# Altium schematic sheet External_Connectors.SchDoc
size A4; SheetNumber: 5; SheetTotal: 11
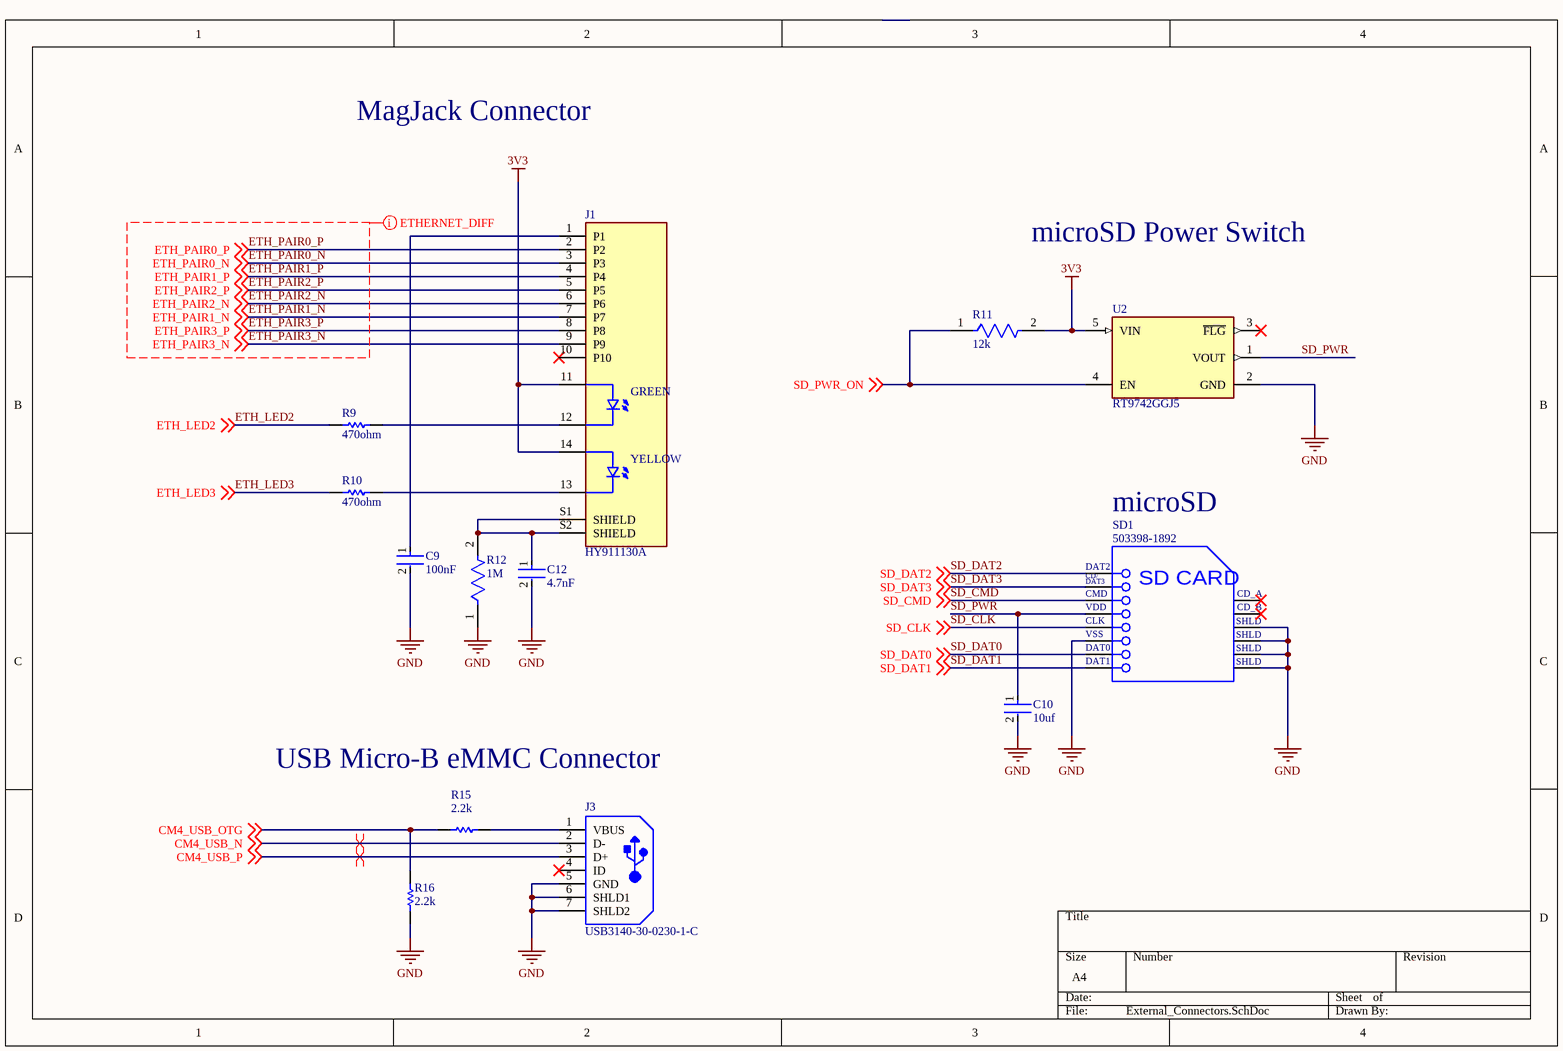
[diagram p0: External_Connectors.SchDoc]

## Parts
C9  100nF  [FP-C0402-BB-MFG]
C10  10uf  [FP-GRM188-0_2-IPC_C]
C12  4.7nF  [FP-0805-L_2_01_0_2-W_1_25-IPC_B]
J1  HY911130A  [HANRUN_HR911130A]
J3  USB3140-30-0230-1-C  [GCT-USB3140_V]
R9  470ohm  [RESC1005X40X25ML05T10]
R10  470ohm  [RESC1005X40X25ML05T10]
R11  12k  [FP-RC0402-0_4-IPC_C]
R12  1M  [FP-ERJ6EN-IPC_A]
R15  2.2k  [RESC1005X40X25LL05T05]
R16  2.2k  [RESC1005X40X25LL05T05]
SD1  503398-1892  [MOLX-503398-1892_V]
U2  RT9742GGJ5  [FP-RT9742GGJ5-IPC_C]

## Nets
3V3: J1.11 J1.14 R11.2 U2.5(VIN)
GND: C9.2 C10.2 C12.2 J3.5(GND) J3.6(SHLD1) J3.7(SHLD2) R12.1 R16.1 SD1.6(VSS) SD1.11(SHLD) SD1.12(SHLD) SD1.13(SHLD) SD1.14(SHLD) U2.2(GND)
CM4_USB_N: J3.2(D-) ; off-sheet CM4_USB_N
CM4_USB_OTG: R15.1 R16.2 ; off-sheet CM4_USB_OTG
CM4_USB_P: J3.3(D+) ; off-sheet CM4_USB_P
ETH_LED2: R9.1 ; off-sheet ETH_LED2
ETH_LED3: R10.1 ; off-sheet ETH_LED3
ETH_PAIR0_N: J1.3(P3) ; off-sheet ETH_PAIR0_N
ETH_PAIR0_P: J1.2(P2) ; off-sheet ETH_PAIR0_P
ETH_PAIR1_N: J1.7(P7) ; off-sheet ETH_PAIR1_N
ETH_PAIR1_P: J1.4(P4) ; off-sheet ETH_PAIR1_P
ETH_PAIR2_N: J1.6(P6) ; off-sheet ETH_PAIR2_N
ETH_PAIR2_P: J1.5(P5) ; off-sheet ETH_PAIR2_P
ETH_PAIR3_N: J1.9(P9) ; off-sheet ETH_PAIR3_N
ETH_PAIR3_P: J1.8(P8) ; off-sheet ETH_PAIR3_P
SD_CLK: SD1.5(CLK) ; off-sheet SD_CLK
SD_CMD: SD1.3(CMD) ; off-sheet SD_CMD
SD_DAT0: SD1.7(DAT0) ; off-sheet SD_DAT0
SD_DAT1: SD1.8(DAT1) ; off-sheet SD_DAT1
SD_DAT2: SD1.1(DAT2) ; off-sheet SD_DAT2
SD_DAT3: SD1.2(CD/DAT3) ; off-sheet SD_DAT3
SD_PWR: C10.1 SD1.4(VDD) U2.1(VOUT)
SD_PWR_ON: R11.1 U2.4(EN) ; off-sheet SD_PWR_ON
NetC9_1: C9.1 J1.1(P1)
NetC12_1: C12.1 J1.S1(SHIELD) J1.S2(SHIELD) R12.2
NetJ1_12: J1.12 R9.2
NetJ1_13: J1.13 R10.2
NetJ3_1: J3.1(VBUS) R15.2

Not connected (* = marked no-connect by the designer): J1 10(P10)*; J3 4(ID)*; SD1 9(CD_A)* 10(CD_B)*; U2 3(~{FLG})*

## Layout directives
differential pair; differential pair class ETHERNET_DIFF_IO; net class ETHERNET_DIFF: ETH_PAIR0_N, ETH_PAIR0_P, ETH_PAIR1_N, ETH_PAIR1_P, ETH_PAIR2_N, ETH_PAIR2_P, ETH_PAIR3_N, ETH_PAIR3_P
differential pair; differential pair class CM4_USB: CM4_USB_N, CM4_USB_P

## Notes on the sheet
- MagJack Connector
- microSD Power Switch
- microSD
- USB Micro-B eMMC Connector
- (in symbol CMP-2000-05621-1) CD/; DAT3; SD CARD
- (in symbol HR911130A) GREEN; YELLOW

## Library data of the parts
C9 = CMP-2008-02046-2: CAP CER 0.1UF 10V X5R 0402; Manufacturer: Kemet; Manufacturer Part Number: C0402C104K8PACTU; Material: Ceramic; Capacitance: 0.10 μF; Temperature Coefficient: 15%; Tolerance: 0.1; Value: 0.10 μF; Package: C0402-BB; Temperature: -55°C to +125°C; ComponentLink2Description: Datasheet; Temperature Characteristic: X5R; Device Class L1: Passive Components; Height: 0.55mm; Lead Free: Yes; ComponentLink2URL: https://content.kemet.com/datasheets/KEM_C1002_X7R_SMD.pdf; Device Class L2: Capacitors; Temperature Range Low: -55°C; Temperature Range High: +125°C; RoHS: TRUE; Octopart: https://octopart.com/c0402c104k8pactu-kemet-140039; Automotive: No; Mouser Description: Capacitor 100 nF 10 VDC 0402; Category: Cap; Voltage Rating: 10 V; Digikey Description: CAP CER 0.1UF 10V X5R 0402; Ipc Land Pattern Name: CAPC10050X50; Device Class L3: Ceramic Capacitors
C10 = CMP-06035-045466-1: Chip Multilayer Ceramic Capacitors for General Purpose, 0603, 10uF, X5R, 15%, 20%, 35V; Case Code (Imperial): 0603; Voltage Rating (DC): 35V; Width: 0.031inch; Dielectric: X5R; Voltage Rating: 35V; Min Operating Temperature: -55°C; Thickness: 0.039inch; Mount: Surface Mount; Case/Package: 0603; Length: 0.063inch; Capacitance: 10uF; Max Operating Temperature: 85°C; Packaging: Tape and Reel; Tolerance: 20%; Case Code (Metric): 1608
C12 = CMP-1036-03594-3: General Purpose Ceramic Capacitor, 0805, 4.7nF, 10%, X7R, 0.15, 50V; Dissipation Factor: 2.5%; Insulation Resistance: 100GR; Depth: 1.25mm; Width: 1.25mm; Construction: Flat; Series: -; Termination: SMD/SMT; Case Code (Imperial): 0805; Voltage Rating: 50V; Number of Pins: 2; Voltage Rating (DC): 50V; Dielectric Material: Ceramic; Capacitance: 4.7nF; Thickness: 0.037inch; Package Quantity: 1; Mount: Surface Mount; Voltage: 50V; Min Operating Temperature: -55°C; Size: 0.94mm; Packaging: Tape and Reel; Dielectric: X7R; RoHS Compliant: Yes; REACH SVHC: No SVHC; Tolerance: 10%; Length: 2.01mm; Lead Free: Lead Free; Radiation Hardening: No; Case/Package: 0805; Case Code (Metric): 2012; Max Operating Temperature: 125°C; Height: 0.94mm; Contact Plating: Tin
J1 = HR911130A: MF: hanrun; SnapEDA_Link: https://www.snapeda.com/parts/HR911130A/HanRun/view-part/?ref=snap; MP: HY911130A; Price: None; Package: None; Check_prices: https://www.snapeda.com/parts/HR911130A/HanRun/view-part/?ref=eda; Value: *; Availability: Not in stock
J3 = CMP-2000-07368-1: Micro USB Receptacle, Type B, SMT, Vertical, with Through-Hole Shell Stakes, -30 to 85 degC, 5-Pin SMD, RoHS, Tape and Reel; Manufacturer: Global Connector Technology; Connector Mounting: PCB; SVHC: NoSVHC(19-Dec-2012); No. of Positions: 5; Connector Type: USB2.0MicroB; No. of Rows: 1; Contact Termination: SurfaceMountVertical; Pitch: 0.65mm; Contact Material: Copper; Gender: Receptacle; PartNumber: USB3140; Series: USB3140; Datasheet URL: http://www.farnell.com/datasheets/1913332.pdf; Contact Plating: Gold; Manufacturer URL: http://gct.co/; Package Reference: USB3140; No. of Contacts: 5; Orientation: Vertical; Datasheet Version: Rev. B2, 04/2015; Package Description: 5-Pin Surface Mount Device, Body 7.8 x 4 mm, Pitch 0.65 mm; Mounting Technology: SurfaceMount
R9 R10 = CMP-2002-07697-1: Part Number: RC0402FR-07470RL; Manufacturer: Yageo / Phycomp
R11 = CMP-2002-07378-2: RES SMD 12K OHM 1% 1/16W 0402; Power Rating: 62.5mW; Voltage Rating: 50V; Resistance: 12kR; Max Power Dissipation: 63mW; Temperature Coefficient: 100ppm/°C; Construction: Rectangular; Case Code (Metric): 1005; Package Quantity: 1; Weight: 2.3E-05oz; RoHS Compliant: Yes; Packaging: Tape and Reel; Case Code (Imperial): 0402; Military Standard: Not; Min Operating Temperature: -55°C; Depth: 0.5mm; Length: 1mm; Width: 0.02inch; Termination: SMD/SMT; Lead Free: Lead Free; Tolerance: 1%; REACH SVHC: No SVHC; Size Code: 0402; Resistance Tolerance: 1%; Series: RC; Max Operating Temperature: 155°C; Height: 0.016inch; Features: Moisture Resistant; Number of Terminations: 2; Case/Package: 0402; Resistor Type: Thick Film
R12 = CMP-2001-04378-6: RES SMD 1M OHM 1% 1/8W 0805; Temperature Coefficient: 100ppm/°C; Resistance: 1MR; Power Rating: 125mW; Voltage Rating: 150V; Length: 2mm; Height: 0.6mm; Technology: THICK FILM; Max Operating Temperature: 155°C; Case Code (Metric): 2012; Number of Terminations: 2; Radiation Hardening: No; Package Quantity: 1; Case Code (Imperial): 0805; Tolerance: 1%; RoHS Compliant: Yes; Contact Plating: Tin; Case/Package: 0805; Max Power Dissipation: 125mW; REACH SVHC: No SVHC; Lead Free: Lead Free; Termination: SMD/SMT; Size Code: 0805; Resistance Tolerance: 1%; Construction: Rectangular; Series: ERJ; Resistor Type: Thick Film; Depth: 1.25mm; Packaging: Tape and Reel; Min Operating Temperature: -55°C; Mount: Surface Mount; Features: Automotive AEC-Q200; Voltage Rating (DC): 150V; Military Standard: Not; Width: 1.2mm; Number of Pins: 2
R15 R16 = CMP-2002-01132-2: Precision Thick Film Chip Resistor, 2.2 kOhm, 100 mW, 1%, -55 to 155 degC, 2-Pin SMD (0402), RoHS, Tape and Reel; Manufacturer: Panasonic; Resistance: 2.2kO; Temp Coefficient: ±100ppm/°C; Rated Power: 0.1W; Datasheet URL: https://datasheet.ciiva.com/11821/0900766b80f80784-11821273.pdf; Tolerance (%): ±1%; Mounting Technology: SurfaceMount; Package Description: 2-Pin Surface Mount Device, Body 1 x 0.5 mm; Manufacturer URL: http://www.panasonic.com/; Datasheet Version: 03/2011; Package Reference: 0402; Size Code: 0402
SD1 = CMP-2000-05621-1: Micro SD Connector, Pitch 1.1 mm, 8 Position, Height 1.4 mm, -25 to 85 degC, RoHS, Tape and Reel; Manufacturer: Molex; Voltage Rating: 10VAC/DC; Current Rating: 500mA; Manufacturer URL: http://www.molex.com/; Package Reference: 503398-1892; Packaging: Reel; RoHS: Details; Brand: Molex; Datasheet URL: http://www.molex.com/pdm_docs/sd/5033981892_sd.pdf; Mounting Technology: SurfaceMount; Factory Pack Quantity: 2400; Datasheet Version: Rev. E, 04/2006; Series: 503398; Product Category: MemoryCardConnectors; Package Description: Micro SD Connector, Pitch 1.1 mm, 8 Position, Height 1.4 mm
U2 = CMP-79883-000001-1: IC PWR SWTCH N-CHAN 1:1 TSOT23-5; Interface: On/Off; Fault Protection: Over Temperature; Max Output Current: 1A; Number of Outputs: 1; Output Configuration: High Side; On-State Resistance: 70mR; REACH SVHC: No SVHC; Number of Pins: 23; Packaging: Tape and Reel; Case/Package: SOT-23-5; RoHS Compliant: Yes; Max Operating Temperature: 85°C; Min Operating Temperature: -40°C